# EAGLE design Simple switch scale (EAGLE 7.6.0)
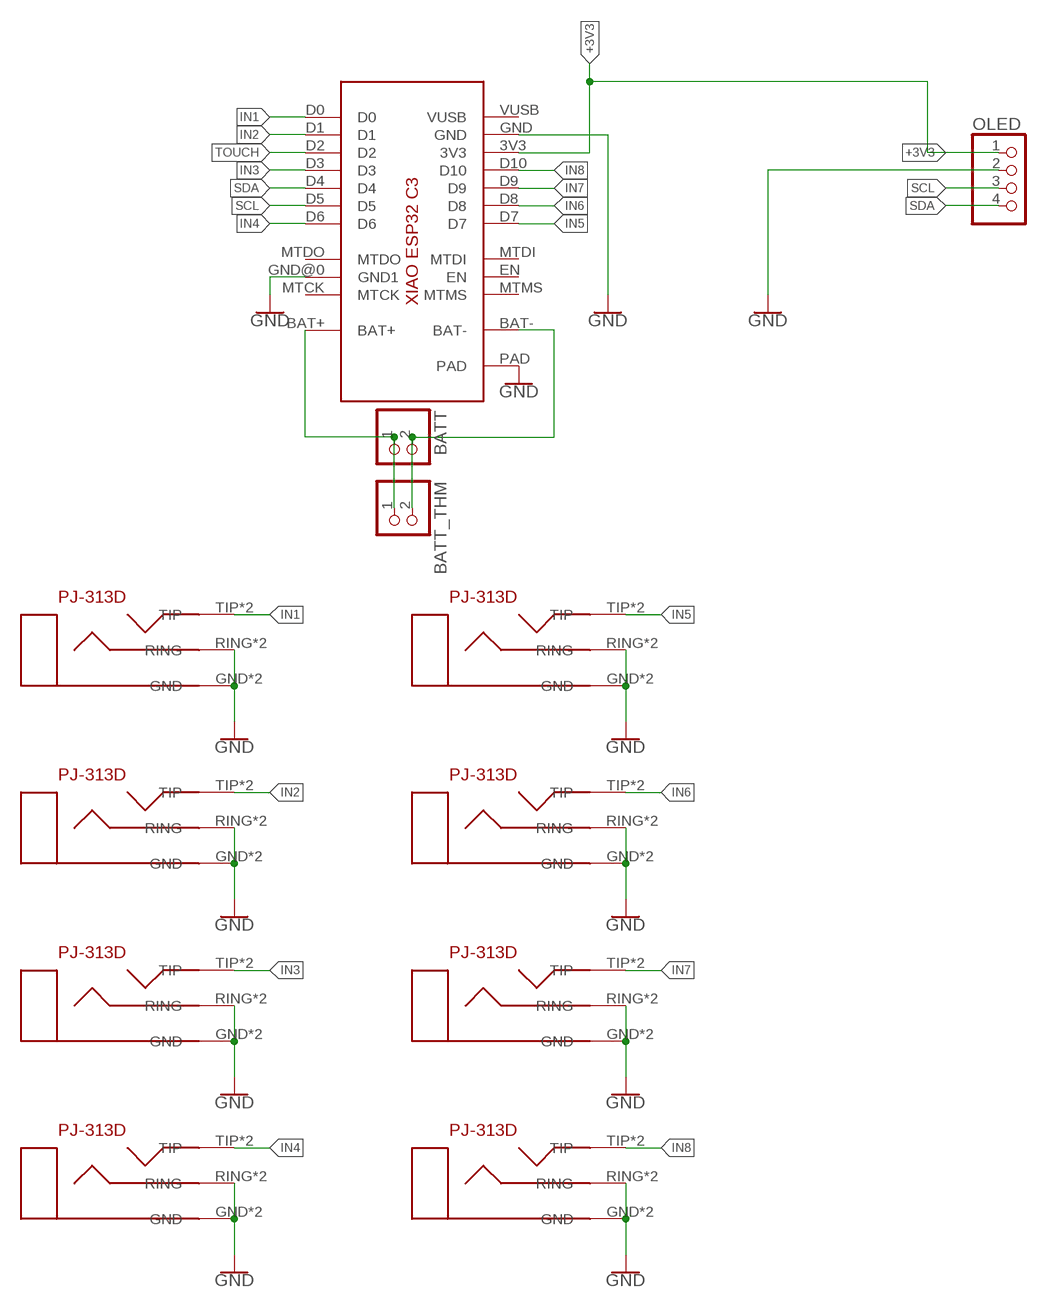
[diagram p0: schematic, sheet 1]

## Parts
BATT  JST_2PIN-SMT-RA  [JST-PH-2-SMT-RA]
BATT_THM  JST_2PIN-THM-RA  [JST-PH-2-THM-RA]
IN1  3.5MM_JACK  [PJ-313D-SMT]
IN2  3.5MM_JACK  [PJ-313D-SMT]
IN3  3.5MM_JACK  [PJ-313D-SMT]
IN4  3.5MM_JACK  [PJ-313D-SMT]
IN5  3.5MM_JACK  [PJ-313D-SMT]
IN6  3.5MM_JACK  [PJ-313D-SMT]
IN7  3.5MM_JACK  [PJ-313D-SMT]
IN8  3.5MM_JACK  [PJ-313D-SMT]
OLED  HEADER-1X4  [1X04_OVAL]
U$1  XIAO_ESP32C3_SMD  [XIAO_ESP32C3_SMD]

## Nets
+3V3: OLED.1 U$1.3V3
GND: IN1.GND IN1.GND0(GND) IN1.RING IN1.RING0(RING) IN2.GND IN2.GND0(GND) IN2.RING IN2.RING0(RING) IN3.GND IN3.GND0(GND) IN3.RING IN3.RING0(RING) IN4.GND IN4.GND0(GND) IN4.RING IN4.RING0(RING) IN5.GND IN5.GND0(GND) IN5.RING IN5.RING0(RING) IN6.GND IN6.GND0(GND) IN6.RING IN6.RING0(RING) IN7.GND IN7.GND0(GND) IN7.RING IN7.RING0(RING) IN8.GND IN8.GND0(GND) IN8.RING IN8.RING0(RING) OLED.2 U$1.GND U$1.GND@0(GND1) U$1.PAD
IN1: IN1.TIP IN1.TIP0(TIP) U$1.D0
IN2: IN2.TIP IN2.TIP0(TIP) U$1.D1
IN3: IN3.TIP IN3.TIP0(TIP) U$1.D3
IN4: IN4.TIP IN4.TIP0(TIP) U$1.D6
IN5: IN5.TIP IN5.TIP0(TIP) U$1.D7
IN6: IN6.TIP IN6.TIP0(TIP) U$1.D8
IN7: IN7.TIP IN7.TIP0(TIP) U$1.D9
IN8: IN8.TIP IN8.TIP0(TIP) U$1.D10
N$1: BATT.1 BATT_THM.1 U$1.BAT+
N$2: BATT.2 BATT_THM.2 U$1.BAT-
SCL: OLED.3 U$1.D5
SDA: OLED.4 U$1.D4
TOUCH: U$1.D2
Unconnected: U$1.EN U$1.MTCK U$1.MTDI U$1.MTDO U$1.MTMS U$1.VUSB

## Library data of the parts
BATT BATT_THM = adafruit:JST_2PIN: JST 2-Pin Connectors of various flavors SMT-RA (S2B-PH-SM4) 4UConnector #17311 SMT (B2B-PH-SM4) THM-RA (S2B-PH) THM (B2B-PH)
IN1-IN8 = CB modules:3.5MM_JACK
OLED = microbuilder:HEADER-1X4: PIN HEADER
U$1 = CB modules:XIAO_ESP32C3_SMD

## Board
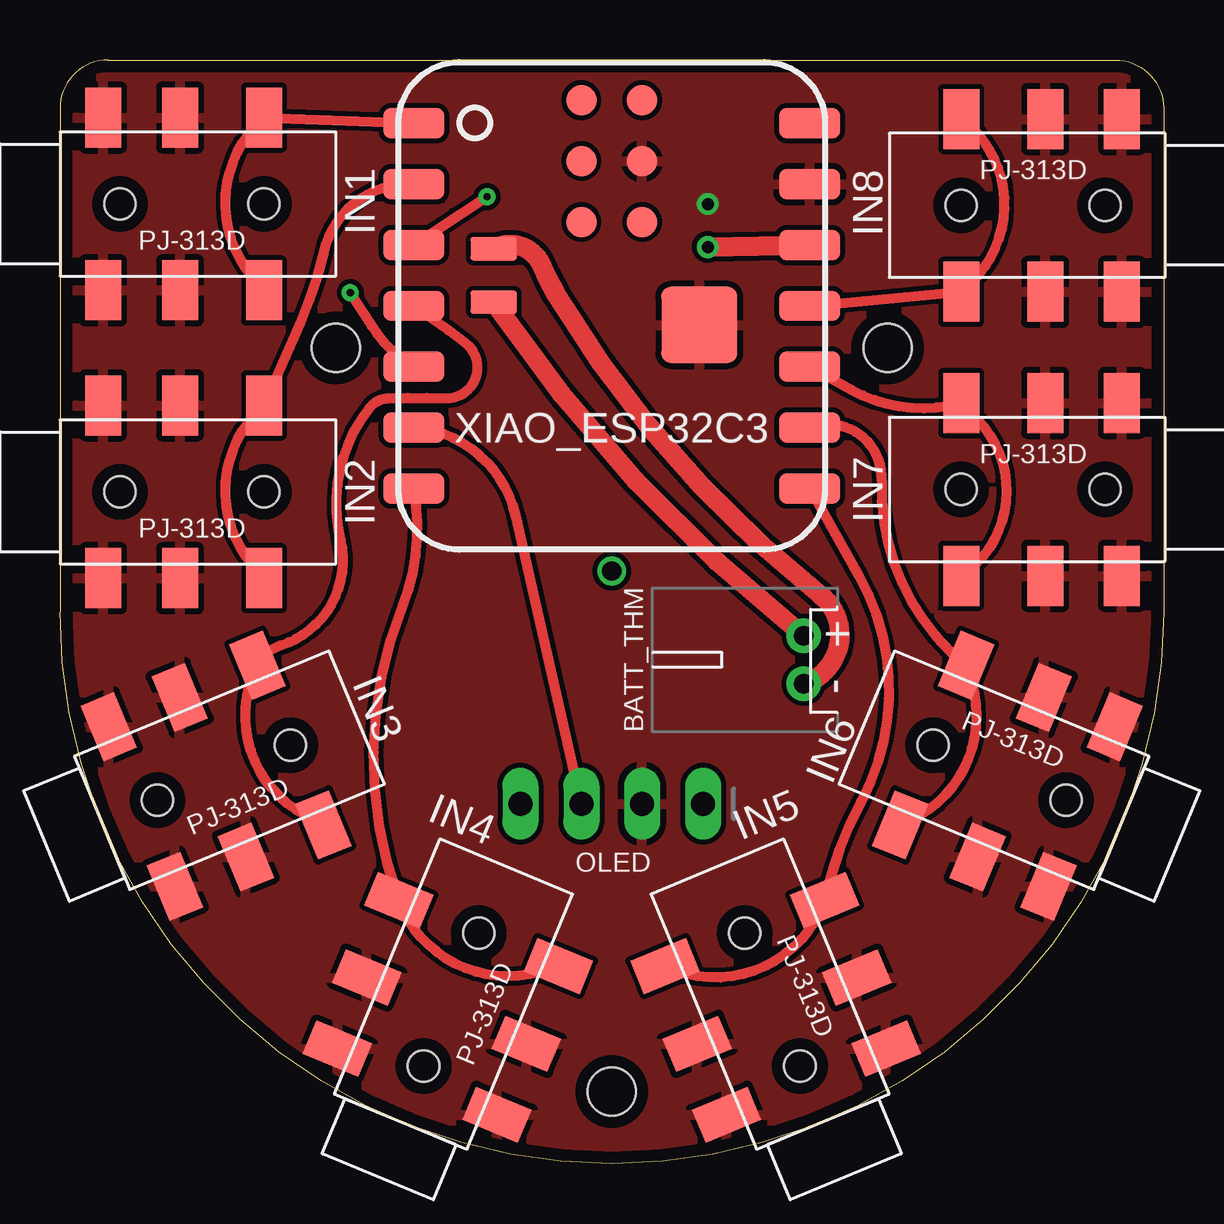
[diagram p1: board, top side]
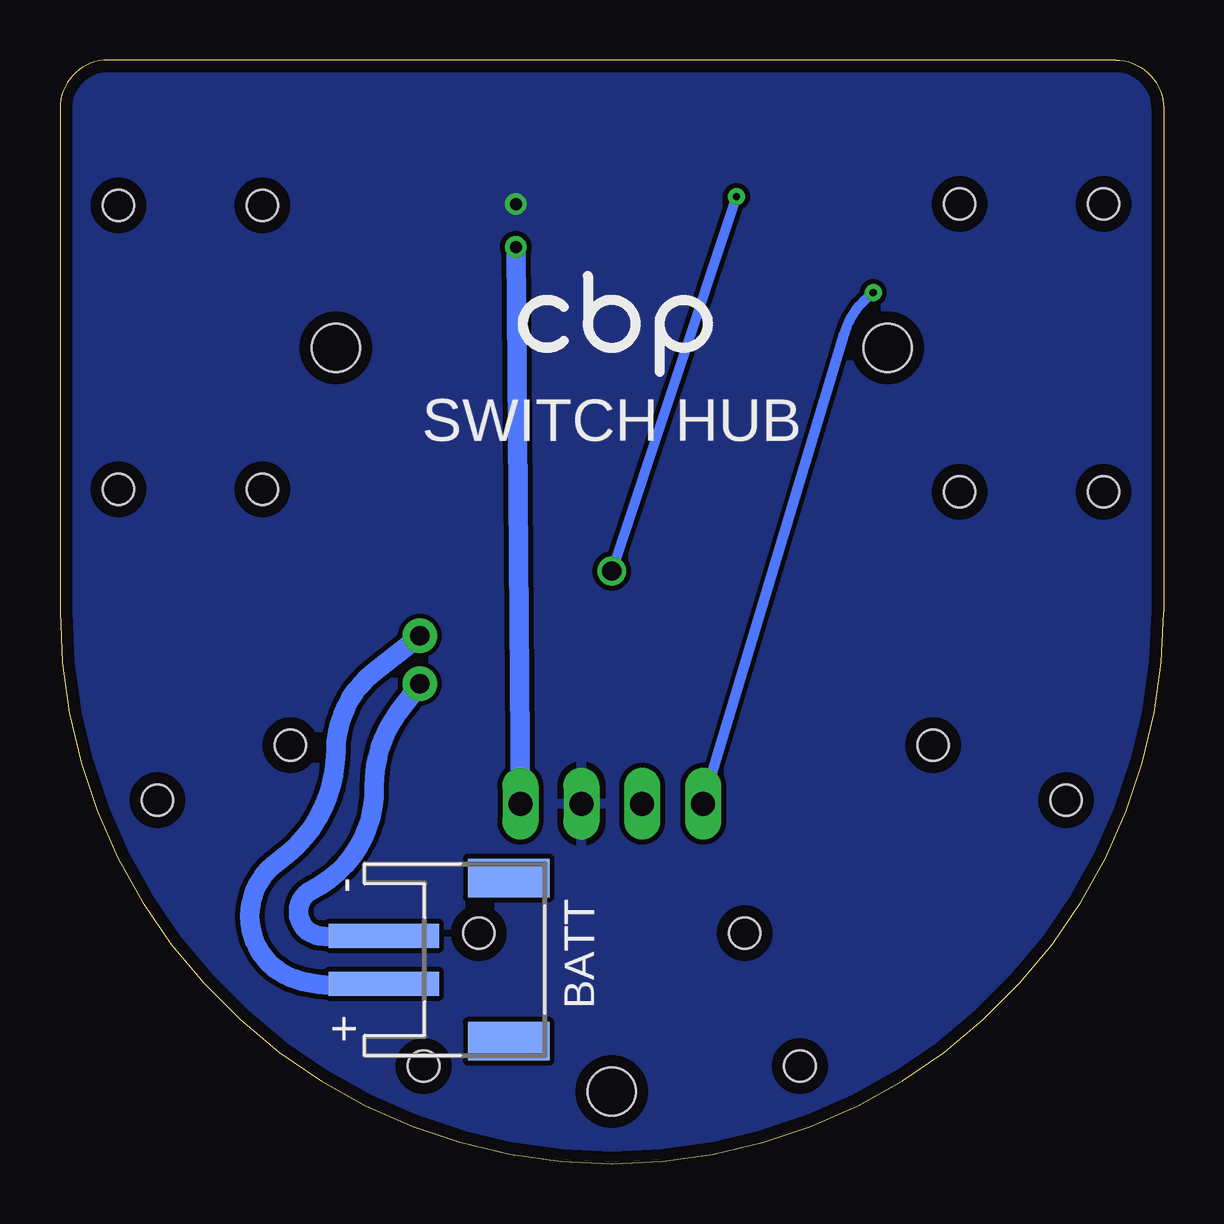
[diagram p2: board, bottom side, seen from below]

Size 46 x 46 mm. Coordinates in mm from the lower left corner, seen from the top.
Outline: 23,0 arc-90 0,23 0,44 arc-90 2,46 44,46 arc-90 46,44 46,23 arc-90 23,0
Copper layers (1*16): Top 0.035mm / dielectric 1.5mm / Bottom 0.035mm
Design rules "default *": minimum track width 10mil, minimum drill 24mil, track to track 8mil, track to pad 8mil, pad to pad 8mil, via to via 8mil, smd to smd 8mil, copper to edge 20mil, drill to drill 8mil, minimum pad ring 10mil, minimum via ring 8mil, stop-mask expansion 4mil, vias tented up to drill 0.4mm, thermal gap 10mil
Holes 2 mm at 34.5,34 11.5,34 23,3

### Footprints (pad centres in the part's own frame; a part is rotated, then mirrored left to right if it is on the bottom)
JST-PH-2-SMT-RA = smd 1 x 4.6: 1 1,-3.7; 2 -1,-3.7 | smd 1.6 x 3.4: NC1 -3.4,1.5; NC2 3.4,1.5
JST-PH-2-THM-RA = drill 0.8 pad 1.422: 1 1,0; 2 -1,0
PJ-313D-SMT = smd 2.5 x 1.5: GND -3.6,-1.8; GND0 3.6,-1.8; RING -3.6,-5; RING0 3.6,-5; TIP -3.6,-8.5; TIP0 3.6,-8.5 | hole 1.3: 0,-8.5; 0,-2.5
1X04_OVAL = drill 1 long: 1 -3.81,0; 2 -1.27,0; 3 1.27,0; 4 3.81,0
XIAO_ESP32C3_SMD = smd 2.54 x 1.27: 3V3 8.255,2.54; D0 -8.255,7.62; D1 -8.255,5.08; D2 -8.255,2.54; D3 -8.255,0; D4 -8.255,-2.54; D5 -8.255,-5.08; D6 -8.255,-7.62; D7 8.255,-7.62; D8 8.255,-5.08; D9 8.255,-2.54; D10 8.255,0; GND 8.255,5.08; VUSB 8.255,7.62 | smd 1.93 x 0.965: BAT+ -4.921,0.159; BAT- -4.921,2.381 | smd 1.27 x 1.27: EN -1.27,6.032; GND@0 1.27,6.032; MTCK 1.27,3.493; MTDI -1.27,8.572; MTDO 1.27,8.572; MTMS -1.27,3.493 | smd 3.175 x 3.175: PAD 3.651,-0.794

### Placement (x,y rotation side)
BATT  28.8,8.5 270 bottom
BATT_THM  31,21 90 top
IN1  0,40 90 top
IN2  0,28 90 top
IN3  1.75,14.19 112.5 top
IN4  14.2,1.75 157.5 top
IN5  31.8,1.75 202.5 top
IN6  44.25,14.19 247.5 top
IN7  46.07,28.1 270 top
IN8  46.07,39.94 270 top
OLED  23,15 180 top
U$1  23,35.75 0 top

### Tracks (layer width: path | path; a pad name or v marks a point on that pad's centre or on a via)
+3V3  (via drill 0.5)
  Top 0.813: v27,38.2 U$1.3V3
  Bottom 0.813: OLED.1 v27,38.2
GND  (via drill 0.5)
  other vias: 27,40
  pour Top: 0,-2 48,-2 48,48 -2,48 -2,-4 0,-4
  pour Bottom: -2,-2 0,-2 0,-4 2,-4 2,-2 48,-2 48,48 -2,48
IN1
  Top 0.406: IN1.TIP 8,37 arc-88 IN1.TIP0 U$1.D0
IN2
  Top 0.406: IN2.TIP 8,25 arc-88 IN2.TIP0 10,35 arc11 11,38 arc-80 U$1.D1
IN3
  Top 0.406: IN3.TIP 10.25,14.5 arc-89 IN3.TIP0 arc-46 9.2,21.6 arc86 11.7,26 arc-51 12.9,31.5 arc-51 13.7,31.9 arc-2 16.1,31.9 arc144 16.9,34.2 arc3 U$1.D3
IN4
  Top 0.406: IN4.TIP 20,8 arc-86 IN4.TIP0 arc-42 14.3,23.3 arc33 U$1.D6
IN5
  Top 0.406: IN5.TIP0 arc96 IN5.TIP arc-16 33.4,15.1 arc58 33.3,24.5 U$1.D7
IN6
  Top 0.406: U$1.D8 arc-112 34.25,28.5 arc53 IN6.TIP 38,20 arc-86 IN6.TIP0
IN7
  Top 0.406: U$1.D9 33,32.25 arc44 IN7.TIP 38.25,31 arc-100 IN7.TIP0
IN8
  Top 0.406: U$1.D10 IN8.TIP0 38,36.75 arc100 IN8.TIP
N$1
  Top 0.813: BATT_THM.1 arc-18 U$1.BAT+
  Bottom 0.813: BATT_THM.1 32.9,20.5 arc-52 34.5,17.2 arc55 36.9,12.6 arc-133 35.9,7.6 arc-21 BATT.1
N$2
  Top 0.813: BATT_THM.2 arc125 31.7,23.7 arc-21 20.7,36.2 arc-9 20.1,37.4 arc96 U$1.BAT-
  Bottom 0.813: BATT_THM.2 31.9,18.8 arc-38 32.9,15.7 arc65 35.5,11.4 arc-145 35.2,9.5 arc-17 BATT.2
SCL
  Top 0.406: OLED.3 19,27 arc73 U$1.D5
SDA  (via drill 0.3)
  Top 0.406: v12.1,36.3 13,34.9 arc26 U$1.D4
  Bottom 0.406: OLED.4 13.3,34.6 arc37 v12.1,36.3
TOUCH  (via drill 0.3, 0.8)
  Top 0.406: v17.8,40.3 U$1.D2
  Bottom 0.406: v23,24.7 v17.8,40.3

### Text on the board
tPlace: FIx these jack positions!
bPlace: SWITCH HUB